# Altium project Hydrogen Bike BMS (100V).PrjPcb (part 1 of 3)
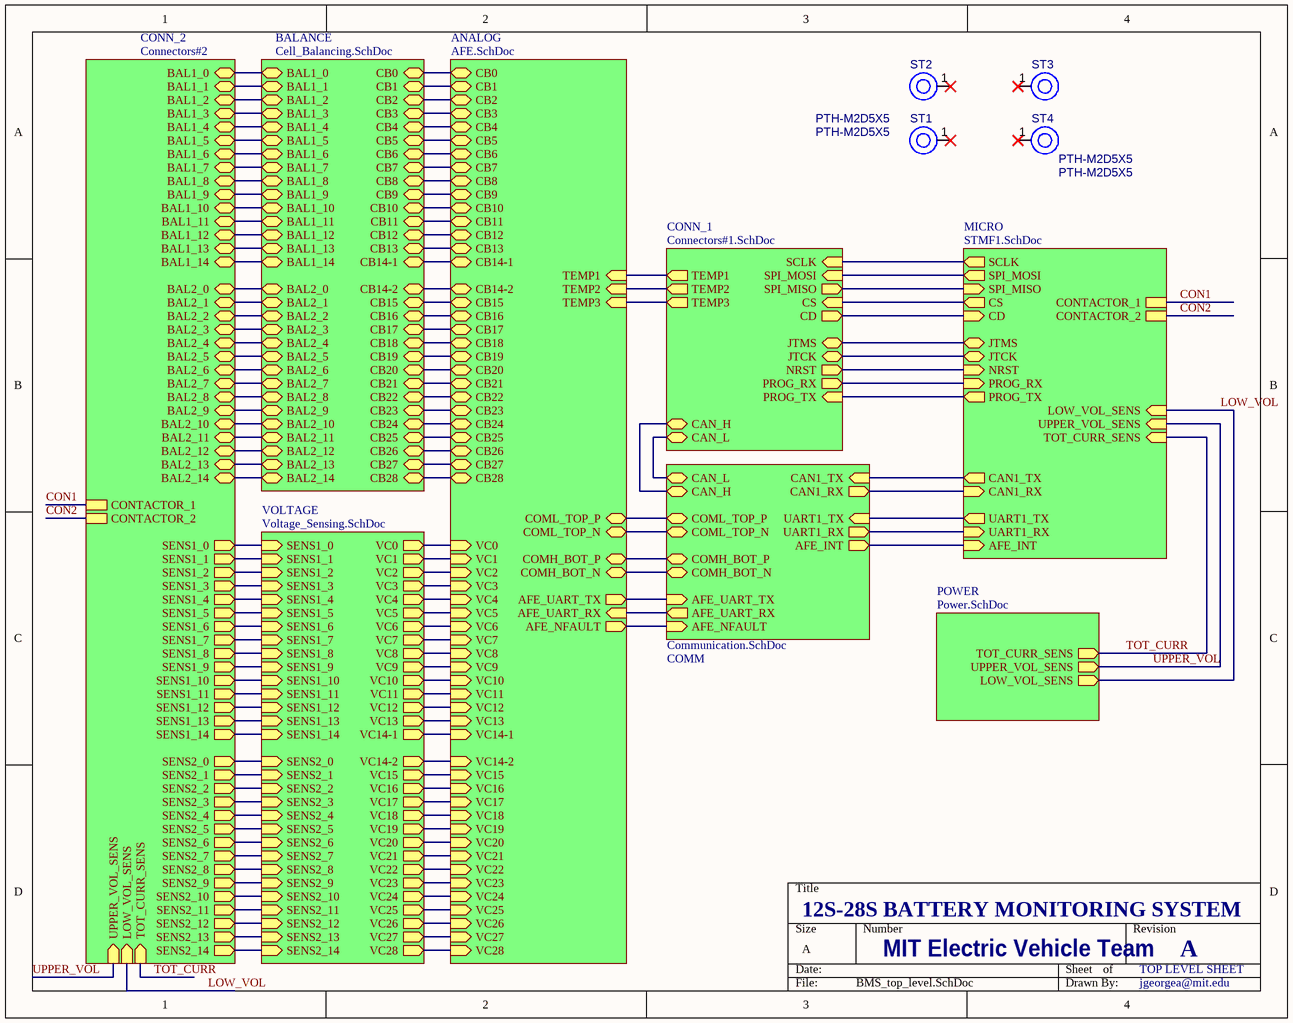
[diagram p0: BMS_top_level.SchDoc]
9 sheets, 279 parts. Net scope: hierarchical (ports join the sheet entries above them; power ports are global).
Board file: PCB1.PcbDoc
Sheets:
  BMS_top_level.SchDoc
    COMM = Communication.SchDoc
    MICRO = STMF1.SchDoc
    CONN_1 = Connectors#1.SchDoc
    ANALOG = AFE.SchDoc
    POWER = Power.SchDoc
    BALANCE = Cell_Balancing.SchDoc
    VOLTAGE = Voltage_Sensing.SchDoc
    CONN_2 = Connectors#2.SchDoc

## Sheet BMS_top_level.SchDoc
size A; SheetNumber: 1; SheetTotal: 9

### Parts
ST1  PTH-M2D5X5  [PTH-M2D5X5]
ST2  PTH-M2D5X5  [PTH-M2D5X5]
ST3  PTH-M2D5X5  [PTH-M2D5X5]
ST4  PTH-M2D5X5  [PTH-M2D5X5]

### Sub-sheets
ANALOG = AFE.SchDoc: COMH_BOT_P (bidir), COMH_BOT_N (bidir), COML_TOP_N (bidir), COML_TOP_P (bidir), CB0 (bidir), CB1 (bidir), CB2 (bidir), CB3 (bidir), CB4 (bidir), CB5 (bidir), CB6 (bidir), CB7 (bidir), CB8 (bidir), CB9 (bidir), CB10 (bidir), CB11 (bidir), CB12 (bidir), CB13 (bidir), CB14-1 (bidir), VC0 (in), VC1 (in), VC2 (in), VC3 (in), VC4 (in), VC5 (in), VC6 (in), VC7 (in), VC8 (in), VC9 (in), VC10 (in), VC11 (in), VC12 (in), VC13 (in), VC14-1 (in), CB14-2 (bidir), CB15 (bidir), CB16 (bidir), CB17 (bidir), CB18 (bidir), CB19 (bidir), CB20 (bidir), CB21 (bidir), CB22 (bidir), CB23 (bidir), CB24 (bidir), CB25 (bidir), CB26 (bidir), CB27 (bidir), CB28 (bidir), VC14-2 (in), VC15 (in), VC16 (in), VC17 (in), VC18 (in), VC19 (in), VC20 (in), VC21 (in), VC22 (in), VC23 (in), VC24 (in), VC25 (in), VC26 (in), VC27 (in), VC28 (in), AFE_UART_TX (out), AFE_UART_RX (in), AFE_NFAULT (out), TEMP1 (in), TEMP2 (in), TEMP3 (in)
BALANCE = Cell_Balancing.SchDoc: CB0 (bidir), CB1 (bidir), CB2 (bidir), CB3 (bidir), CB4 (bidir), CB5 (bidir), CB6 (bidir), CB7 (bidir), CB8 (bidir), CB9 (bidir), CB10 (bidir), CB11 (bidir), CB12 (bidir), CB13 (bidir), CB14-1 (bidir), CB14-2 (bidir), CB15 (bidir), CB16 (bidir), CB17 (bidir), CB18 (bidir), CB19 (bidir), CB20 (bidir), CB21 (bidir), CB22 (bidir), CB23 (bidir), CB24 (bidir), CB25 (bidir), CB26 (bidir), CB27 (bidir), CB28 (bidir), BAL1_0 (bidir), BAL1_1 (bidir), BAL1_2 (bidir), BAL1_3 (bidir), BAL1_4 (bidir), BAL1_5 (bidir), BAL1_6 (bidir), BAL1_7 (bidir), BAL1_8 (bidir), BAL1_9 (bidir), BAL1_10 (bidir), BAL1_11 (bidir), BAL1_12 (bidir), BAL1_13 (bidir), BAL1_14 (bidir), BAL2_0 (bidir), BAL2_1 (bidir), BAL2_2 (bidir), BAL2_3 (bidir), BAL2_4 (bidir), BAL2_5 (bidir), BAL2_6 (bidir), BAL2_7 (bidir), BAL2_8 (bidir), BAL2_9 (bidir), BAL2_10 (bidir), BAL2_11 (bidir), BAL2_12 (bidir), BAL2_13 (bidir), BAL2_14 (bidir)
COMM = Communication.SchDoc: CAN_H (bidir), CAN_L (bidir), CAN1_RX (out), CAN1_TX (in), COMH_BOT_P (bidir), COMH_BOT_N (bidir), COML_TOP_P (bidir), COML_TOP_N (bidir), AFE_UART_TX (in), UART1_RX (out), UART1_TX (in), AFE_UART_RX (out), AFE_NFAULT (in), AFE_INT (out)
CONN_1 = Connectors#1.SchDoc: SPI_MISO (out), SCLK (in), SPI_MOSI (in), CS (in), PROG_RX (out), PROG_TX (in), NRST (out), JTCK (bidir), JTMS (bidir), CAN_H (bidir), CAN_L (bidir), CD (out), TEMP1 (out), TEMP2 (out), TEMP3 (out)
CONN_2 = Connectors#2: SENS1_0 (out), SENS1_1 (out), SENS1_2 (out), SENS1_3 (out), SENS1_4 (out), SENS1_5 (out), SENS1_6 (out), SENS1_7 (out), SENS1_8 (out), SENS1_9 (out), SENS1_10 (out), SENS1_11 (out), SENS1_12 (out), SENS1_13 (out), SENS1_14 (out), SENS2_0 (out), SENS2_1 (out), SENS2_2 (out), SENS2_3 (out), SENS2_4 (out), SENS2_5 (out), SENS2_6 (out), SENS2_7 (out), SENS2_8 (out), SENS2_9 (out), SENS2_10 (out), SENS2_11 (out), SENS2_12 (out), SENS2_13 (out), SENS2_14 (out), BAL1_0 (bidir), BAL1_1 (bidir), BAL1_2 (bidir), BAL1_3 (bidir), BAL1_4 (bidir), BAL1_5 (bidir), BAL1_6 (bidir), BAL1_7 (bidir), BAL1_8 (bidir), BAL1_9 (bidir), BAL1_10 (bidir), BAL1_11 (bidir), BAL1_12 (bidir), BAL1_13 (bidir), BAL1_14 (bidir), BAL2_0 (bidir), BAL2_1 (bidir), BAL2_2 (bidir), BAL2_3 (bidir), BAL2_4 (bidir), BAL2_5 (bidir), BAL2_6 (bidir), BAL2_7 (bidir), BAL2_8 (bidir), BAL2_9 (bidir), BAL2_10 (bidir), BAL2_11 (bidir), BAL2_12 (bidir), BAL2_13 (bidir), BAL2_14 (bidir), CONTACTOR_2, CONTACTOR_1, UPPER_VOL_SENS (in), LOW_VOL_SENS (in), TOT_CURR_SENS (in)
MICRO = STMF1.SchDoc: NRST (in), SCLK (out), SPI_MISO (in), SPI_MOSI (out), CS (out), UART1_TX (out), UART1_RX (in), CAN1_RX (in), CAN1_TX (out), JTMS (bidir), JTCK (bidir), PROG_RX (in), PROG_TX (out), AFE_INT (in), CD (in), TOT_CURR_SENS (in), CONTACTOR_1, CONTACTOR_2, LOW_VOL_SENS (in), UPPER_VOL_SENS (in)
POWER = Power.SchDoc: TOT_CURR_SENS (out), UPPER_VOL_SENS (out), LOW_VOL_SENS (out)
VOLTAGE = Voltage_Sensing.SchDoc: VC0 (out), VC1 (out), VC2 (out), VC3 (out), VC4 (out), VC5 (out), SENS1_0 (in), VC6 (out), VC7 (out), VC8 (out), VC9 (out), VC10 (out), VC11 (out), VC12 (out), VC13 (out), VC14-1 (out), VC14-2 (out), VC15 (out), VC16 (out), VC17 (out), VC18 (out), VC19 (out), VC20 (out), VC21 (out), VC22 (out), VC23 (out), VC24 (out), VC25 (out), VC26 (out), VC27 (out), VC28 (out), SENS1_1 (in), SENS1_2 (in), SENS1_3 (in), SENS1_4 (in), SENS1_5 (in), SENS1_6 (in), SENS1_7 (in), SENS1_8 (in), SENS1_9 (in), SENS1_10 (in), SENS1_11 (in), SENS1_12 (in), SENS1_13 (in), SENS1_14 (in), SENS2_0 (in), SENS2_1 (in), SENS2_2 (in), SENS2_3 (in), SENS2_4 (in), SENS2_5 (in), SENS2_6 (in), SENS2_7 (in), SENS2_8 (in), SENS2_9 (in), SENS2_10 (in), SENS2_11 (in), SENS2_12 (in), SENS2_13 (in), SENS2_14 (in)

### Nets
AFE_NFAULT: sheet COMM/AFE_NFAULT, sheet ANALOG/AFE_NFAULT
AFE_UART_N: sheet COMM/AFE_UART_RX, sheet ANALOG/AFE_UART_RX
AFE_UART_P: sheet COMM/AFE_UART_TX, sheet ANALOG/AFE_UART_TX
CAN1_N: sheet COMM/CAN1_TX, sheet MICRO/CAN1_TX
CAN1_P: sheet COMM/CAN1_RX, sheet MICRO/CAN1_RX
CAN_N: sheet COMM/CAN_L, sheet CONN_1/CAN_L
CAN_P: sheet COMM/CAN_H, sheet CONN_1/CAN_H
CB11: sheet ANALOG/CB11, sheet BALANCE/CB11
CB21: sheet ANALOG/CB21, sheet BALANCE/CB21
COMH_BOT_N: sheet COMM/COMH_BOT_N, sheet ANALOG/COMH_BOT_N
COMH_BOT_P: sheet COMM/COMH_BOT_P, sheet ANALOG/COMH_BOT_P
COML_TOP_N: sheet COMM/COML_TOP_N, sheet ANALOG/COML_TOP_N
COML_TOP_P: sheet COMM/COML_TOP_P, sheet ANALOG/COML_TOP_P
CON1: sheet MICRO/CONTACTOR_1, sheet CONN_2/CONTACTOR_1
CON2: sheet MICRO/CONTACTOR_2, sheet CONN_2/CONTACTOR_2
JTCK: sheet MICRO/JTCK, sheet CONN_1/JTCK
JTMS: sheet MICRO/JTMS, sheet CONN_1/JTMS
LOW_VOL: sheet MICRO/LOW_VOL_SENS, sheet POWER/LOW_VOL_SENS, sheet CONN_2/LOW_VOL_SENS
NRST: sheet MICRO/NRST, sheet CONN_1/NRST
PROG_N: sheet MICRO/PROG_RX, sheet CONN_1/PROG_RX
PROG_P: sheet MICRO/PROG_TX, sheet CONN_1/PROG_TX
TOT_CURR: sheet MICRO/TOT_CURR_SENS, sheet POWER/TOT_CURR_SENS, sheet CONN_2/TOT_CURR_SENS
UART1_N: sheet COMM/UART1_TX, sheet MICRO/UART1_TX
UART1_P: sheet COMM/UART1_RX, sheet MICRO/UART1_RX
UPPER_VOL: sheet MICRO/UPPER_VOL_SENS, sheet POWER/UPPER_VOL_SENS, sheet CONN_2/UPPER_VOL_SENS
VC11: sheet ANALOG/VC11, sheet VOLTAGE/VC11
VC21: sheet ANALOG/VC21, sheet VOLTAGE/VC21
NetC21_1: sheet ANALOG/CB1, sheet BALANCE/CB1
NetC21_2: sheet ANALOG/CB0, sheet BALANCE/CB0
NetC22_1: sheet ANALOG/CB2, sheet BALANCE/CB2
NetC23_1: sheet ANALOG/CB3, sheet BALANCE/CB3
NetC24_1: sheet ANALOG/CB4, sheet BALANCE/CB4
NetC25_1: sheet ANALOG/CB5, sheet BALANCE/CB5
NetC26_1: sheet ANALOG/CB6, sheet BALANCE/CB6
NetC27_1: sheet ANALOG/CB7, sheet BALANCE/CB7
NetC28_1: sheet ANALOG/CB8, sheet BALANCE/CB8
NetC29_1: sheet ANALOG/CB9, sheet BALANCE/CB9
NetC30_1: sheet ANALOG/CB10, sheet BALANCE/CB10
NetC32_1: sheet ANALOG/CB12, sheet BALANCE/CB12
NetC33_1: sheet ANALOG/CB13, sheet BALANCE/CB13
NetC34_1: sheet ANALOG/CB14-1, sheet BALANCE/CB14-1
NetC61_1: sheet ANALOG/CB15, sheet BALANCE/CB15
NetC61_2: sheet ANALOG/CB14-2, sheet BALANCE/CB14-2
NetC62_1: sheet ANALOG/CB16, sheet BALANCE/CB16
NetC63_1: sheet ANALOG/CB17, sheet BALANCE/CB17
NetC64_1: sheet ANALOG/CB18, sheet BALANCE/CB18
NetC65_1: sheet ANALOG/CB19, sheet BALANCE/CB19
NetC66_1: sheet ANALOG/CB20, sheet BALANCE/CB20
NetC68_1: sheet ANALOG/CB22, sheet BALANCE/CB22
NetC70_1: sheet ANALOG/CB23, sheet BALANCE/CB23
NetC71_1: sheet ANALOG/CB24, sheet BALANCE/CB24
NetC72_1: sheet ANALOG/CB25, sheet BALANCE/CB25
NetC73_1: sheet ANALOG/CB26, sheet BALANCE/CB26
NetC74_1: sheet ANALOG/CB27, sheet BALANCE/CB27
NetC75_1: sheet ANALOG/CB28, sheet BALANCE/CB28
NetC80_1: sheet ANALOG/VC0, sheet VOLTAGE/VC0
NetC81_1: sheet ANALOG/VC1, sheet VOLTAGE/VC1
NetC82_1: sheet ANALOG/VC2, sheet VOLTAGE/VC2
NetC83_1: sheet ANALOG/VC3, sheet VOLTAGE/VC3
NetC84_1: sheet ANALOG/VC4, sheet VOLTAGE/VC4
NetC85_1: sheet ANALOG/VC5, sheet VOLTAGE/VC5
NetC86_1: sheet ANALOG/VC6, sheet VOLTAGE/VC6
NetC87_1: sheet ANALOG/VC7, sheet VOLTAGE/VC7
NetC88_1: sheet ANALOG/VC8, sheet VOLTAGE/VC8
NetC89_1: sheet ANALOG/VC9, sheet VOLTAGE/VC9
NetC90_1: sheet ANALOG/VC10, sheet VOLTAGE/VC10
NetC92_1: sheet ANALOG/VC12, sheet VOLTAGE/VC12
NetC93_1: sheet ANALOG/VC13, sheet VOLTAGE/VC13
NetC94_1: sheet ANALOG/VC14-1, sheet VOLTAGE/VC14-1
NetC95_1: sheet ANALOG/VC14-2, sheet VOLTAGE/VC14-2
NetC96_1: sheet ANALOG/VC15, sheet VOLTAGE/VC15
NetC97_1: sheet ANALOG/VC16, sheet VOLTAGE/VC16
NetC98_1: sheet ANALOG/VC17, sheet VOLTAGE/VC17
NetC99_1: sheet ANALOG/VC18, sheet VOLTAGE/VC18
NetC100_1: sheet ANALOG/VC19, sheet VOLTAGE/VC19
NetC101_1: sheet ANALOG/VC20, sheet VOLTAGE/VC20
NetC103_1: sheet ANALOG/VC22, sheet VOLTAGE/VC22
NetC104_1: sheet ANALOG/VC23, sheet VOLTAGE/VC23
NetC105_1: sheet ANALOG/VC24, sheet VOLTAGE/VC24
NetC106_1: sheet ANALOG/VC25, sheet VOLTAGE/VC25
NetC107_1: sheet ANALOG/VC26, sheet VOLTAGE/VC26
NetC108_1: sheet ANALOG/VC27, sheet VOLTAGE/VC27
NetC109_1: sheet ANALOG/VC28, sheet VOLTAGE/VC28
NetJ2_2: sheet MICRO/CS, sheet CONN_1/CS
NetJ2_3: sheet MICRO/SPI_MOSI, sheet CONN_1/SPI_MOSI
NetJ2_5: sheet MICRO/SCLK, sheet CONN_1/SCLK
NetJ2_7: sheet MICRO/SPI_MISO, sheet CONN_1/SPI_MISO
NetJ2_10: sheet MICRO/CD, sheet CONN_1/CD
NetJ4_1: sheet BALANCE/BAL1_0, sheet CONN_2/BAL1_0
NetJ4_2: sheet BALANCE/BAL1_1, sheet CONN_2/BAL1_1
NetJ4_3: sheet BALANCE/BAL1_2, sheet CONN_2/BAL1_2
NetJ4_4: sheet BALANCE/BAL1_3, sheet CONN_2/BAL1_3
NetJ4_5: sheet BALANCE/BAL1_4, sheet CONN_2/BAL1_4
NetJ4_6: sheet BALANCE/BAL1_5, sheet CONN_2/BAL1_5
NetJ4_7: sheet BALANCE/BAL1_6, sheet CONN_2/BAL1_6
NetJ4_8: sheet BALANCE/BAL1_7, sheet CONN_2/BAL1_7
NetJ4_9: sheet BALANCE/BAL1_8, sheet CONN_2/BAL1_8
NetJ4_10: sheet BALANCE/BAL1_9, sheet CONN_2/BAL1_9
NetJ4_11: sheet BALANCE/BAL1_10, sheet CONN_2/BAL1_10
NetJ4_12: sheet BALANCE/BAL1_11, sheet CONN_2/BAL1_11
NetJ4_13: sheet BALANCE/BAL1_12, sheet CONN_2/BAL1_12
NetJ4_14: sheet BALANCE/BAL1_13, sheet CONN_2/BAL1_13
NetJ4_15: sheet BALANCE/BAL1_14, sheet CONN_2/BAL1_14
NetJ5_1: sheet BALANCE/BAL2_0, sheet CONN_2/BAL2_0
NetJ5_2: sheet BALANCE/BAL2_1, sheet CONN_2/BAL2_1
NetJ5_3: sheet BALANCE/BAL2_2, sheet CONN_2/BAL2_2
NetJ5_4: sheet BALANCE/BAL2_3, sheet CONN_2/BAL2_3
NetJ5_5: sheet BALANCE/BAL2_4, sheet CONN_2/BAL2_4
NetJ5_6: sheet BALANCE/BAL2_5, sheet CONN_2/BAL2_5
NetJ5_7: sheet BALANCE/BAL2_6, sheet CONN_2/BAL2_6
NetJ5_8: sheet BALANCE/BAL2_7, sheet CONN_2/BAL2_7
NetJ5_9: sheet BALANCE/BAL2_8, sheet CONN_2/BAL2_8
NetJ5_10: sheet BALANCE/BAL2_9, sheet CONN_2/BAL2_9
NetJ5_11: sheet BALANCE/BAL2_10, sheet CONN_2/BAL2_10
NetJ5_12: sheet BALANCE/BAL2_11, sheet CONN_2/BAL2_11
NetJ5_13: sheet BALANCE/BAL2_12, sheet CONN_2/BAL2_12
NetJ5_14: sheet BALANCE/BAL2_13, sheet CONN_2/BAL2_13
NetJ5_15: sheet BALANCE/BAL2_14, sheet CONN_2/BAL2_14
NetJ6_1: sheet VOLTAGE/SENS2_0, sheet CONN_2/SENS2_0
NetJ6_2: sheet VOLTAGE/SENS2_1, sheet CONN_2/SENS2_1
NetJ6_3: sheet VOLTAGE/SENS2_2, sheet CONN_2/SENS2_2
NetJ6_4: sheet VOLTAGE/SENS2_3, sheet CONN_2/SENS2_3
NetJ6_5: sheet VOLTAGE/SENS2_4, sheet CONN_2/SENS2_4
NetJ6_6: sheet VOLTAGE/SENS2_5, sheet CONN_2/SENS2_5
NetJ6_7: sheet VOLTAGE/SENS2_6, sheet CONN_2/SENS2_6
NetJ6_8: sheet VOLTAGE/SENS2_7, sheet CONN_2/SENS2_7
NetJ6_9: sheet VOLTAGE/SENS2_8, sheet CONN_2/SENS2_8
NetJ6_10: sheet VOLTAGE/SENS2_9, sheet CONN_2/SENS2_9
NetJ6_11: sheet VOLTAGE/SENS2_10, sheet CONN_2/SENS2_10
NetJ6_12: sheet VOLTAGE/SENS2_11, sheet CONN_2/SENS2_11
NetJ6_13: sheet VOLTAGE/SENS2_12, sheet CONN_2/SENS2_12
NetJ6_14: sheet VOLTAGE/SENS2_13, sheet CONN_2/SENS2_13
NetJ6_15: sheet VOLTAGE/SENS2_14, sheet CONN_2/SENS2_14
NetJ7_1: sheet VOLTAGE/SENS1_0, sheet CONN_2/SENS1_0
NetJ7_2: sheet VOLTAGE/SENS1_1, sheet CONN_2/SENS1_1
NetJ7_3: sheet VOLTAGE/SENS1_2, sheet CONN_2/SENS1_2
NetJ7_4: sheet VOLTAGE/SENS1_3, sheet CONN_2/SENS1_3
NetJ7_5: sheet VOLTAGE/SENS1_4, sheet CONN_2/SENS1_4
NetJ7_6: sheet VOLTAGE/SENS1_5, sheet CONN_2/SENS1_5
NetJ7_7: sheet VOLTAGE/SENS1_6, sheet CONN_2/SENS1_6
NetJ7_8: sheet VOLTAGE/SENS1_7, sheet CONN_2/SENS1_7
NetJ7_9: sheet VOLTAGE/SENS1_8, sheet CONN_2/SENS1_8
NetJ7_10: sheet VOLTAGE/SENS1_9, sheet CONN_2/SENS1_9
NetJ7_11: sheet VOLTAGE/SENS1_10, sheet CONN_2/SENS1_10
NetJ7_12: sheet VOLTAGE/SENS1_11, sheet CONN_2/SENS1_11
NetJ7_13: sheet VOLTAGE/SENS1_12, sheet CONN_2/SENS1_12
NetJ7_14: sheet VOLTAGE/SENS1_13, sheet CONN_2/SENS1_13
NetJ7_15: sheet VOLTAGE/SENS1_14, sheet CONN_2/SENS1_14
NetP1_1: sheet CONN_1/TEMP1, sheet ANALOG/TEMP1
NetP1_2: sheet CONN_1/TEMP2, sheet ANALOG/TEMP2
NetP1_3: sheet CONN_1/TEMP3, sheet ANALOG/TEMP3
NetU01_15: sheet COMM/AFE_INT, sheet MICRO/AFE_INT

Not connected (* = marked no-connect by the designer): ST1 1(H1)*; ST2 1(H1)*; ST3 1(H1)*; ST4 1(H1)*

### Notes on the sheet
- 12S-28S BATTERY MONITORING SYSTEM
- MIT Electric Vehicle Team
- TOP LEVEL SHEET
- A
- jgeorgea@mit.edu

### Library data of the parts
ST1-ST4 = CMP-00028-00004-2: M2 PTH (2.5mm), 5mm pad; Pins: 1

## Sheet Communication.SchDoc
size A; SheetNumber: 3; SheetTotal: 9
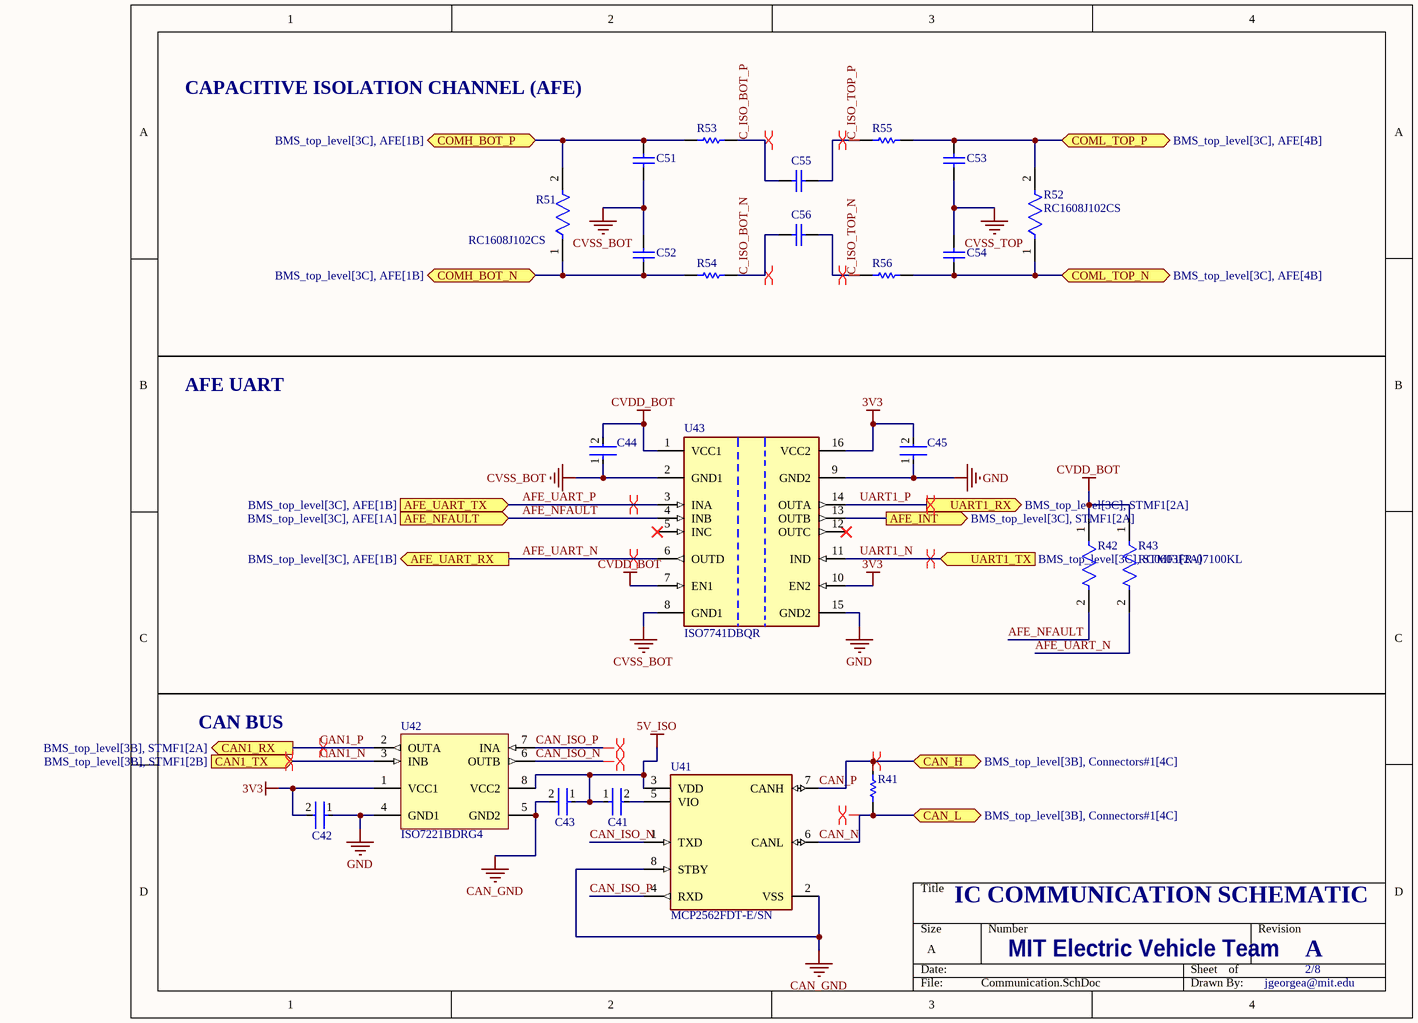
[diagram p1: Communication.SchDoc]

### Parts
C41  CGA3E2X7R1H104K080AA  [FP-CGA3E-0_3-0_1-IPC_A]  (value not drawn)
C42  CGA3E2X7R1H104K080AA  [FP-CGA3E-0_3-0_1-IPC_A]  (value not drawn)
C43  CGA3E2X7R1H104K080AA  [FP-CGA3E-0_3-0_1-IPC_A]  (value not drawn)
C44  CGA3E2X7R1H104K080AA  [FP-CGA3E-0_3-0_1-IPC_A]  (value not drawn)
C45  CGA3E2X7R1H104K080AA  [FP-CGA3E-0_3-0_1-IPC_A]  (value not drawn)
C51  06031C221KAT2A  [CAPC1608X90X35ML15T15]  (value not drawn)
C52  06031C221KAT2A  [CAPC1608X90X35ML15T15]  (value not drawn)
C53  06031C221KAT2A  [CAPC1608X90X35ML15T15]  (value not drawn)
C54  06031C221KAT2A  [CAPC1608X90X35ML15T15]  (value not drawn)
C55  08051C222JAT2A  [CAPC2013X94X50LL20T25]  (value not drawn)
C56  08051C222JAT2A  [CAPC2013X94X50LL20T25]  (value not drawn)
R41  ERJ-3EKF1200V  [RESC1609X55X30ML15T15]  (value not drawn)
R42  RC0603FR-07100KL  [FP-RC0603-0_55-MFG]  (value not drawn)
R43  RC0603FR-07100KL  [FP-RC0603-0_55-MFG]
R51  RC1608J102CS  [FP-RC1608-IPC_A]
R52  RC1608J102CS  [FP-RC1608-IPC_A]
R53  48R7 1% 0603(1608)  [RESC0603(1608)_M]  (value not drawn)
R54  48R7 1% 0603(1608)  [RESC0603(1608)_M]  (value not drawn)
R55  48R7 1% 0603(1608)  [RESC0603(1608)_M]  (value not drawn)
R56  48R7 1% 0603(1608)  [RESC0603(1608)_M]  (value not drawn)
U41  MCP2562FDT-E/SN  [FP-C04-057-SN-MFG]
U42  ISO7221BDRG4  [D0008B_M]
U43  ISO7741DBQR  [FP-DBQ0016A-MFG]

### Ports
AFE_INT (out, see BMS_top_level[3C], STMF1[2A]), AFE_NFAULT (in, see BMS_top_level[3C], AFE[1A]), AFE_UART_RX (out, see BMS_top_level[3C], AFE[1B]), AFE_UART_TX (in, see BMS_top_level[3C], AFE[1B]), CAN1_RX (out, see BMS_top_level[3B], STMF1[2A]), CAN1_TX (in, see BMS_top_level[3B], STMF1[2B]), CAN_H (bidir, see BMS_top_level[3B], Connectors#1[4C]), CAN_L (bidir, see BMS_top_level[3B], Connectors#1[4C]), COMH_BOT_N (bidir, see BMS_top_level[3C], AFE[1B]), COMH_BOT_P (bidir, see BMS_top_level[3C], AFE[1B]), COML_TOP_N (bidir, see BMS_top_level[3C], AFE[4B]), COML_TOP_P (bidir, see BMS_top_level[3C], AFE[4B]), UART1_RX (out, see BMS_top_level[3C], STMF1[2A]), UART1_TX (in, see BMS_top_level[3C], STMF1[2A])

### Nets
3V3: C42.2 C45.2 U42.1(VCC1) U43.10(EN2) U43.16(VCC2)
5V_ISO: C41.1 C43.1 U41.3(VDD) U42.8(VCC2)
CAN_GND: C43.2 U41.2(VSS) U41.8(STBY) U42.5(GND2)
CVDD_BOT: C44.2 R42.1 R43.1 U43.1(VCC1) U43.7(EN1)
CVSS_BOT: C44.1 C51.1 C52.1 U43.2(GND1) U43.8(GND1)  [project net AVSS_BOT]
CVSS_TOP: C53.1 C54.1  [project net AVSS_TOP]
GND: C42.1 C45.1 U42.4(GND1) U43.9(GND2) U43.15(GND2)
AFE_NFAULT: R42.2 U43.4(INB) ; port AFE_NFAULT
AFE_UART_N: R43.2 U43.6(OUTD) ; port AFE_UART_RX
AFE_UART_P: U43.3(INA) ; port AFE_UART_TX
C_ISO_BOT_N: C56.1 R54.2
C_ISO_BOT_P: C55.1 R53.2
C_ISO_TOP_N: C56.2 R56.1
C_ISO_TOP_P: C55.2 R55.1
CAN1_N: U42.3(INB) ; port CAN1_TX
CAN1_P: U42.2(OUTA) ; port CAN1_RX
CAN_ISO_N: U41.1(TXD) U42.6(OUTB)
CAN_ISO_P: U41.4(RXD) U42.7(INA)
CAN_N: R41.1 U41.6(CANL) ; port CAN_L
CAN_P: R41.2 U41.7(CANH) ; port CAN_H
COMH_BOT_N: C52.2 R51.1 R54.1 ; port COMH_BOT_N
COMH_BOT_P: C51.2 R51.2 R53.1 ; port COMH_BOT_P
COML_TOP_N: C54.2 R52.1 R56.2 ; port COML_TOP_N
COML_TOP_P: C53.2 R52.2 R55.2 ; port COML_TOP_P
UART1_N: U43.11(IND) ; port UART1_TX
UART1_P: U43.14(OUTA) ; port UART1_RX
NetC41_2: C41.2 U41.5(VIO)
NetU01_15: U43.13(OUTB) ; port AFE_INT

Not connected (* = marked no-connect by the designer): U43 5(INC)* 12(OUTC)*

### Layout directives
differential pair: AFE_UART_N, AFE_UART_P, C_ISO_BOT_N, C_ISO_BOT_P, C_ISO_TOP_N, C_ISO_TOP_P, CAN1_N, CAN1_P, CAN_ISO_N, CAN_ISO_P, CAN_N, CAN_P, UART1_N, UART1_P

### Notes on the sheet
- CAPACITIVE ISOLATION CHANNEL (AFE)
- AFE UART
- CAN BUS
- IC COMMUNICATION SCHEMATIC
- MIT Electric Vehicle Team
- 2/8
- A
- jgeorgea@mit.edu

### Library data of the parts
C41-C45 = CMP-2000-07546-2: Cap Ceramic 100nF 50V X7R 10% Pad SMD 0603 +125°C Automotive T/R; Weight: 7.1E-05oz; Composition: Ceramic; Max Operating Temperature: 125°C; Termination: SMD/SMT; Dielectric: X7R; Length: 1.6mm; Package Quantity: 1; REACH SVHC: No SVHC; Lead Free: Lead Free; Case Code (Metric): 1608; Min Operating Temperature: -55°C; Packaging: Tape and Reel; Tolerance: 10%; Voltage Rating: 50V; Case Code (Imperial): 0603; Capacitance: 100nF; Case/Package: 0603; Voltage Rating (DC): 50V; Depth: 0.8mm; Radiation Hardening: No; Ratings: AEC-Q200; Mount: Surface Mount; Voltage: 50V; Thickness: 0.035inch; Width: 0.8mm; Height: 0.8mm
C51-C54 = CMP-2006-04084-1: Manufacturer: AVX Interconnect / Elco; Part Number: 06031C221KAT2A
C55 C56 = CMP-2007-04184-1: Manufacturer: AVX Interconnect / Elco; Part Number: 08051C222JAT2A
R41 = CMP-2000-00213-2: Chip Resistor, 120 Ohm, +/- 1%, 0.1 W, -55 to 155 degC, 0603 (1608 Metric), RoHS, Tape and Reel; Manufacturer: Panasonic; Power Rating: 100mW; Voltage Rating (DC): 75V; Resistance: 120Ohm; Temperature Coefficient: 100ppm/degreesC; Number of Terminations: 2; Military Standard: Not; Tolerance: 1%; Min Operating Temperature: -55degC; Packaging: TapeandReel; Lead Free: LeadFree; Max Operating Temperature: 155degC; Manufacturer URL: http://www.panasonic.com/; Case Code (Imperial): 0603; REACH SVHC: NoSVHC; Width: 0.031inch; Datasheet URL: https://industrial.panasonic.com/cdbs/www-data/pdf/RDA0000/AOA0000C283.pdf; RoHSCompliant: true; Max Power Dissipation: 100mW; Termination: SMD/SMT; Package Reference: 0603; Height: 0.022inch; Depth: 0.8mm; Package Description: 2-Pin Surface Mount Device, Body 1.6 x 0.85 mm; Contact Plating: Tin; Length: 1.6mm; Package URL: http://www.st.com/st-web-ui/static/active/en/resource/technical/document/datasheet/CD00001320.pdf; Radiation Hardening: No; Package Quantity: 1; Number of Pins: 2; Datasheet Version: 42095.0; Voltage Rating: 75V; Composition: ThickFilm; Case/Package: 0603; Mount: SurfaceMount; Case Code (Metric): 1608
R42 R43 = CMP-2100-03662-2: RES SMD 100K OHM 1% 1/10W 0603; Voltage Rating (DC): 50V; Resistance: 100kR; Max Power Dissipation: 100mW; Temperature Coefficient: 100ppm/°C; Working Voltage: 75V; Length: 1.6mm; Lead Free: Lead Free; Number of Terminations: 2; Packaging: Tape and Reel; Voltage Rating: 50V; Termination: SMD/SMT; Width: 0.8mm; Resistor Type: Thick Film; Resistance Tolerance: 1%; Features: Moisture Resistant; Height: 0.45mm; Construction: Rectangular; Case/Package: 0603; Military Standard: Not; Case Code (Imperial): 0603; Series: RC; Technology: THICK FILM; Depth: 0.8mm; RoHS Compliant: Yes; REACH SVHC: No SVHC; Min Operating Temperature: -55°C; Case Code (Metric): 1608; Max Operating Temperature: 155°C; Power Rating: 100mW; Number of Pins: 2; Tolerance: 1%
R51 R52 = CMP-13261-002301-1: Res Thick Film 0603 1kΩ 5% 0.1W ±100ppm/°C Molded SMD T/R; Power Rating: 100mW; Resistance: 1kR; Voltage Rating (DC): 50V; Contact Plating: Tin; Mount: Surface Mount; Number of Terminations: 2; Features: Moisture Resistant; Max Power Dissipation: 100mW; Military Standard: Not; Case/Package: 0603; Radiation Hardening: No; Temperature Coefficient: 100ppm/°C; Length: 1.6mm; Height: 0.022inch; Case Code (Metric): 1608; Max Operating Temperature: 155°C; Composition: Thick Film; Tolerance: 5%; Width: 0.031inch; Depth: 0.8mm; Packaging: Tape and Reel; Lead Free: Lead Free; Case Code (Imperial): 0603; Min Operating Temperature: -55°C
R53-R56 = CMP-1012-00362-1: 48R7 0.1W 1% 0603 (1608 Metric)  SMD; Case-Metric: 1608; Case-EIA: 0603; Value: 48.70 Ohm; Power: 0.1 W; Tolerance: 1 %; Technology: SMT
U41 = CMP-06279-000005-1: IC TRANSCEIVER 1/1 8SOIC; Operating Supply Current: 70mA; Data Rate: 8Mbps; Number of Transceivers: 1; Receiver Hysteresis: 200mV; Max Supply Voltage: 5.5V; Min Supply Voltage: 4.5V; Weight: 0.019048oz; Package Quantity: 3300; Case/Package: SOIC; Mount: Surface Mount; Max Operating Temperature: 125°C; Min Operating Temperature: -40°C; Packaging: Tape and Reel; Number of Pins: 8
U42 = CMP-0328-00081-3: 5 Mbps Dual Channels, 1 / 1, Digital Isolator, 3.3 V / 5 V, -40 to +125 degC, 8-pin SOIC (D), Green (RoHS & no Sb/Br); Manufacturer: Texas Instruments; TTL/CMOS Input Threshold: TTL; Input Noise Filter: Yes; Datarate(Mbps): 5; Insulation Rating(VRMS): 2500; Rating: Catalog; Supply Voltage(s)(V): 3.3, 5; Eco-Plan: Green (RoHS & no Sb/Br); SubFamily: Isolator; PackageReference: D0008B; ComponentLink3URL: SamplesURL:http://www.ti.com/product/iso7221b#samples; ComponentLink1URL: http://www.ti.com/; ComponentLink2Description: Datasheet; Mounting Technology: Surface Mount; ComponentLink1Description: Manufacturer URL; Channel Configuration: 02/01/2000; PartNumber: ISO7221BDRG4; PackageVersion: revM, Jun-2011; ComponentLink2URL: http://www.ti.com/general/docs/lit/getliterature.tsp?genericPartNumber=ISO7221B&fileType=pdf; DatasheetVersion: SLLS755L; Thermal Shutdown: No; PackageDescription: 8-Pin Plastic Small Outline Integrated Circuit, 4.9 x 3.9 mm, Pitch 1.27 mm Pitch; ComponentLink3Description: URL Link1
U43 = CMP-04872-000008-1: Manufacturer: Texas Instruments; Nominal Supply Current: 0.8-18mA; Standoff Height: 0.11mm; Interface: SPI; Max Supply Voltage: 5.5V; Min Supply Voltage: 2.25V; Max Junction Temp: +150°C; Automotive: No; Ambient Temperature Range High: +125°C; Height: 1.75mm; Octopart: https://octopart.com/iso7741dbqr-texas+instruments-82338409; Temperature Range High: +125°C; Device Class L1: Integrated Circuits (ICs); Lead Free: Yes; Ambient Temperature Range Low: -55°C; Digikey Description: ISO7741DBQR; Package: DBQ0016A; Temperature: -55°C to +125°C; ComponentLink2URL: http://www.ti.com/lit/ds/symlink/iso7741.pdf; Category: IC; Manufacturer Part Number: ISO7741DBQR; Device Class L2: Interface ICs; Mouser Description: High-speed, low-power, robust EMC quad-channel digital isolator 16-SSOP -55 to 125; ComponentLink2Description: Datasheet; Temperature Range Low: -55°C; Device Class L3: unset; RoHS: TRUE

## Sheet STMF1.SchDoc
size A; SheetNumber: 2; SheetTotal: 9
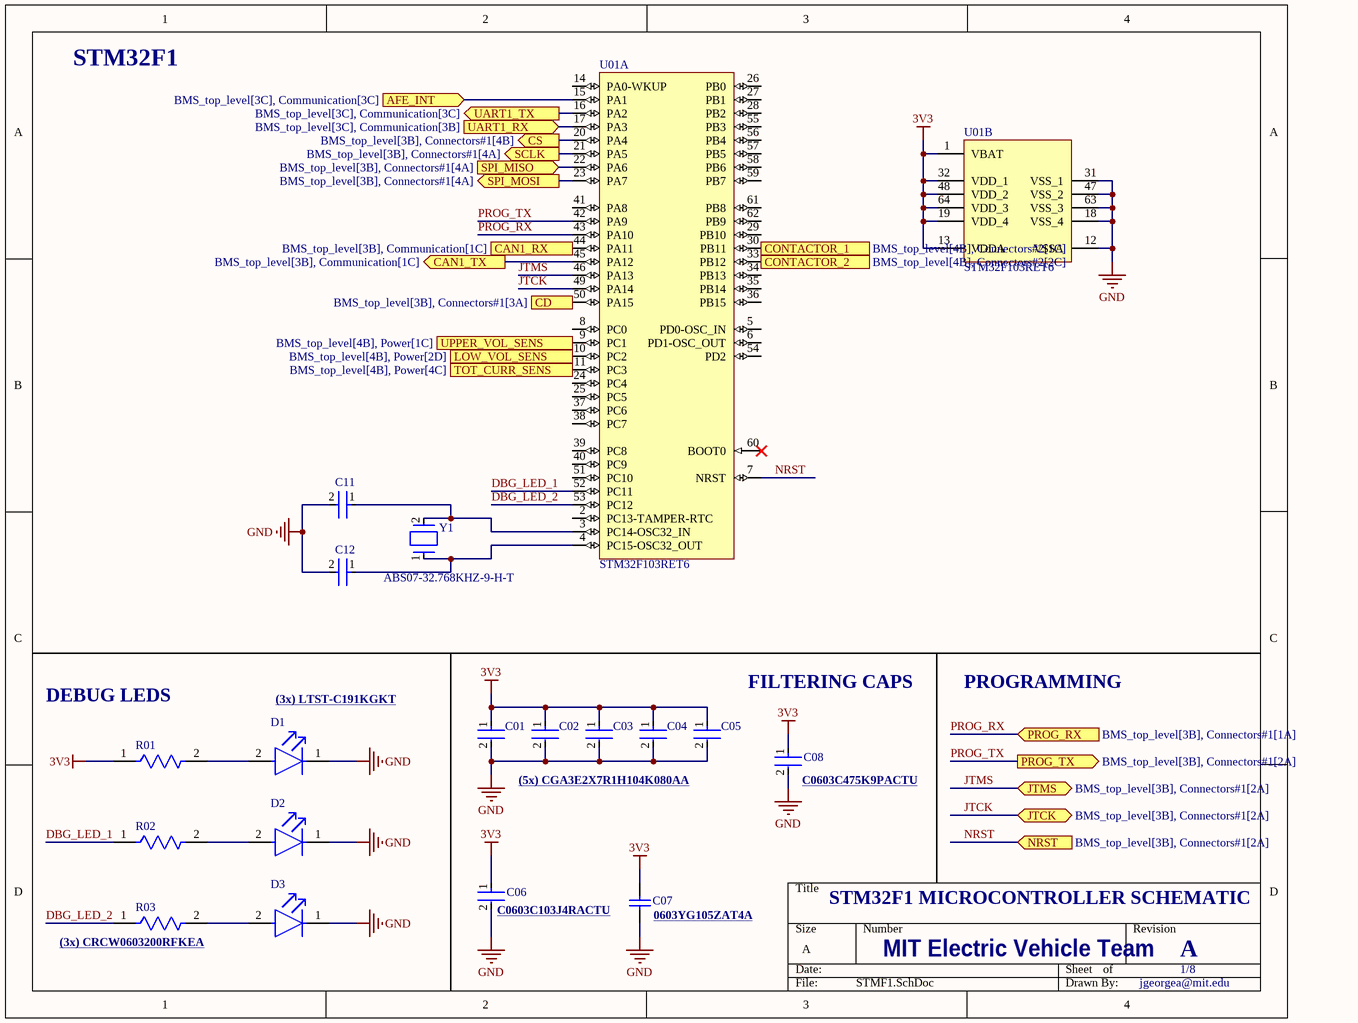
[diagram p2: STMF1.SchDoc]

### Parts
C01  CGA3E2X7R1H104K080AA  [FP-CGA3E-0_3-0_1-IPC_A]  (value not drawn)
C02  CGA3E2X7R1H104K080AA  [FP-CGA3E-0_3-0_1-IPC_A]  (value not drawn)
C03  CGA3E2X7R1H104K080AA  [FP-CGA3E-0_3-0_1-IPC_A]  (value not drawn)
C04  CGA3E2X7R1H104K080AA  [FP-CGA3E-0_3-0_1-IPC_A]  (value not drawn)
C05  CGA3E2X7R1H104K080AA  [FP-CGA3E-0_3-0_1-IPC_A]  (value not drawn)
C06  C0603C103J4RACTU  [FP-C0603C-CF-MFG]  (value not drawn)
C07  0603YG105ZAT4A  [CAPC1608X90X35ML15T15]  (value not drawn)
C08  C0603C475K9PACTU  [FP-C0603-CG-MFG]  (value not drawn)
C11  CBR06C409A1GAC  [FP-CBR06C-MFG]  (value not drawn)
C12  CBR06C409A1GAC  [FP-CBR06C-MFG]  (value not drawn)
D1  LTST-C191KGKT  [FP-LTST-C191KGKT-MFG]  (value not drawn)
D2  LTST-C191KGKT  [FP-LTST-C191KGKT-MFG]  (value not drawn)
D3  LTST-C191KGKT  [FP-LTST-C191KGKT-MFG]  (value not drawn)
R01  CRCW0603200RFKEA  [FP-CRCW0603-e3-MFG]  (value not drawn)
R02  CRCW0603200RFKEA  [FP-CRCW0603-e3-MFG]  (value not drawn)
R03  CRCW0603200RFKEA  [FP-CRCW0603-e3-MFG]  (value not drawn)
U01  STM32F103RET6  [STM-LQFP64_L]  (parts A,B of 2)
Y1  ABS07-32.768KHZ-9-H-T  [FP-ABS07-MFG]

### Ports
AFE_INT (in, see BMS_top_level[3C], Communication[3C]), CAN1_RX (in, see BMS_top_level[3B], Communication[1C]), CAN1_TX (out, see BMS_top_level[3B], Communication[1C]), CD (in, see BMS_top_level[3B], Connectors#1[3A]), CONTACTOR_1 (see BMS_top_level[4B], Connectors#2[1C]), CONTACTOR_2 (see BMS_top_level[4B], Connectors#2[2C]), CS (out, see BMS_top_level[3B], Connectors#1[4B]), JTCK (bidir, see BMS_top_level[3B], Connectors#1[2A]), JTMS (bidir, see BMS_top_level[3B], Connectors#1[2A]), LOW_VOL_SENS (in, see BMS_top_level[4B], Power[2D]), NRST (in, see BMS_top_level[3B], Connectors#1[2A]), PROG_RX (in, see BMS_top_level[3B], Connectors#1[1A]), PROG_TX (out, see BMS_top_level[3B], Connectors#1[2A]), SCLK (out, see BMS_top_level[3B], Connectors#1[4A]), SPI_MISO (in, see BMS_top_level[3B], Connectors#1[4A]), SPI_MOSI (out, see BMS_top_level[3B], Connectors#1[4A]), TOT_CURR_SENS (in, see BMS_top_level[4B], Power[4C]), UART1_RX (in, see BMS_top_level[3C], Communication[3B]), UART1_TX (out, see BMS_top_level[3C], Communication[3C]), UPPER_VOL_SENS (in, see BMS_top_level[4B], Power[1C])

### Nets
3V3: C01.1 C02.1 C03.1 C04.1 C05.1 C06.1 C07.2 C08.1 R01.1 U01.1(VBAT) U01.13(VDDA) U01.19(VDD_4) U01.32(VDD_1) U01.48(VDD_2) U01.64(VDD_3)
GND: C01.2 C02.2 C03.2 C04.2 C05.2 C06.2 C07.1 C08.2 C11.2 C12.2 D1.1(C) D2.1(C) D3.1(C) U01.12(VSSA) U01.18(VSS_4) U01.31(VSS_1) U01.47(VSS_2) U01.63(VSS_3)
CAN1_N: U01.45(PA12) ; port CAN1_TX
CAN1_P: U01.44(PA11) ; port CAN1_RX
CON1: U01.30(PB11) ; port CONTACTOR_1
CON2: U01.33(PB12) ; port CONTACTOR_2
DBG_LED_1: R02.1 U01.52(PC11)
DBG_LED_2: R03.1 U01.53(PC12)
JTCK: U01.49(PA14) ; port JTCK
JTMS: U01.46(PA13) ; port JTMS
LOW_VOL: U01.10(PC2) ; port LOW_VOL_SENS
NRST: U01.7(NRST) ; port NRST
PROG_RX: U01.43(PA10) ; port PROG_RX  [project net PROG_N]
PROG_TX: U01.42(PA9) ; port PROG_TX  [project net PROG_P]
TOT_CURR: U01.11(PC3) ; port TOT_CURR_SENS
UART1_N: U01.16(PA2) ; port UART1_TX
UART1_P: U01.17(PA3) ; port UART1_RX
UPPER_VOL: U01.9(PC1) ; port UPPER_VOL_SENS
NetC11_1: C11.1 U01.3(PC14-OSC32_IN) Y1.2
NetC12_1: C12.1 U01.4(PC15-OSC32_OUT) Y1.1
NetD1_2: D1.2(A) R01.2
NetD2_2: D2.2(A) R02.2
NetD3_2: D3.2(A) R03.2
NetJ2_2: U01.20(PA4) ; port CS
NetJ2_3: U01.23(PA7) ; port SPI_MOSI
NetJ2_5: U01.21(PA5) ; port SCLK
NetJ2_7: U01.22(PA6) ; port SPI_MISO
NetJ2_10: U01.50(PA15) ; port CD
NetU01_15: U01.15(PA1) ; port AFE_INT

Not connected (* = marked no-connect by the designer): U01 2(PC13-TAMPER-RTC) 5(PD0-OSC_IN) 6(PD1-OSC_OUT) 8(PC0) 14(PA0-WKUP) 24(PC4) 25(PC5) 26(PB0) 27(PB1) 28(PB2) 29(PB10) 34(PB13) 35(PB14) 36(PB15) 37(PC6) 38(PC7) 39(PC8) 40(PC9) 41(PA8) 51(PC10) 54(PD2) 55(PB3) 56(PB4) 57(PB5) 58(PB6) 59(PB7) 60(BOOT0)* 61(PB8) 62(PB9)

### Notes on the sheet
- STM32F1
- DEBUG LEDS
- (3x) LTST-C191KGKT
- FILTERING CAPS
- PROGRAMMING
- (5x) CGA3E2X7R1H104K080AA
- (near C08) C0603C475K9PACTU
- STM32F1 MICROCONTROLLER SCHEMATIC
- (near R03) (3x) CRCW0603200RFKEA
- (near C06) C0603C103J4RACTU
- (near C07) 0603YG105ZAT4A
- MIT Electric Vehicle Team
- A
- 1/8
- jgeorgea@mit.edu

### Library data of the parts
C01 C02 C03 C04 C05 = CMP-2000-07546-2: as C41 on sheet Communication; Weight: 7.1E-05oz; Composition: Ceramic; Max Operating Temperature: 125°C; Termination: SMD/SMT; Dielectric: X7R; Length: 1.6mm; Package Quantity: 1; REACH SVHC: No SVHC; Lead Free: Lead Free; Case Code (Metric): 1608; Min Operating Temperature: -55°C; Packaging: Tape and Reel; Tolerance: 10%; Voltage Rating: 50V; Case Code (Imperial): 0603; Capacitance: 100nF; Case/Package: 0603; Voltage Rating (DC): 50V; Depth: 0.8mm; Radiation Hardening: No; Ratings: AEC-Q200; Mount: Surface Mount; Voltage: 50V; Thickness: 0.035inch; Width: 0.8mm; Height: 0.8mm
C06 = CMP-2006-03033-2: CAP CER 10000PF 16V 5% X7R 0603; Manufacturer: KEMET; Value: 10,000 pF; Tolerance: 0.05; Material: Ceramic; Temperature Coefficient: 30ppm/°C; Automotive Grade: Grade 1; Height: 0.87mm; Temperature Range High: +125°C; Temperature Range Low: -55°C; Automotive: Yes; Package: C0603C-CF; Temperature Characteristic: X7R; RoHS: TRUE; Device Class L2: Capacitors; Device Class L3: Ceramic Capacitors; Device Class L1: Passive Components; Manufacturer Part Number: C0603C103J4RACTU; Voltage Rating: 16 V; ComponentLink2URL: https://api.kemet.com/component-edge/download/datasheet/C0603C100J5GACAUTO.pdf; ComponentLink2Description: Datasheet; Mouser Description: Multilayer Ceramic Capacitors MLCC - SMD/SMT 16volts 10000pF X7R 5%; Temperature: -55°C to +125°C; Digikey Description: CAP CER 10000PF 16V 5% X7R 0603; Octopart: https://octopart.com/c0603c103j4ractu-kemet-9139447; Capacitance: 10,000 pF; Category: Cap; Lead Free: Yes
C07 = CMP-2006-04543-1: Manufacturer: AVX Interconnect / Elco; Part Number: 0603YG105ZAT4A
C08 = CMP-2006-02256-2: CAP CER 4.7UF 6.3V X5R 0603; Manufacturer: Kemet; Temperature Coefficient: 15%; Tolerance: 10%; Material: Ceramic; Device Class L3: Ceramic Capacitors; RoHS: TRUE; Value: 4.7uF; Lead Free: Yes; ComponentLink2Description: Datasheet; Mouser Description: Multilayer Ceramic Capacitors MLCC - SMD/SMT 6.3volts 4.7uF X5R 10%; Package: C0603-CG; Digikey Description: CAP CER 4.7UF 6.3V X5R 0603; ComponentLink2URL: https://content.kemet.com/datasheets/KEM_C1006_X5R_SMD.pdf; Category: Cap; Temperature Range Low: -55°C; Capacitance: 4.7uF; Temperature: -55°C to +85°C; Octopart: https://octopart.com/c0603c475k9pactu-kemet-104242; Ipc Land Pattern Name: CAPC16080X80; Voltage Rating: 6.3V; Temperature Range High: +85°C; Height: 0.9mm; Temperature Characteristic: X5R; Device Class L1: Passive Components; Manufacturer Part Number: C0603C475K9PACTU; Automotive: No; Device Class L2: Capacitors
C11 C12 = CMP-03020-005801-1: CAP CER 4PF 100V NP0 0603; Manufacturer: KEMET; Temperature Coefficient: 30ppm/°C; Material: Ceramic; Value: 4.0 pF; Temperature Characteristic: C0G; Tolerance: 0.05 pF; Automotive: No; Temperature Range Low: -55°C; Package: CBR06C; Ipc Land Pattern Name: CAPC16080X80; Temperature: -55°C to +125°C; Device Class L2: Capacitors; RoHS: TRUE; Device Class L1: Passive Components; Mouser Description: Multilayer Ceramic Capacitors MLCC - SMD/SMT 4pF 100volts; Temperature Range High: +125°C; Height: 0.87mm; ComponentLink2URL: https://content.kemet.com/datasheets/KEM_C1030_CBR_SMD.pdf; Octopart: https://octopart.com/cbr06c409a1gac-kemet-23801648; Device Class L3: Ceramic Capacitors; Lead Free: Yes; Manufacturer Part Number: CBR06C409A1GAC; Voltage Rating: 100 V; Category: Cap; Capacitance: 4.0 pF; Digikey Description: CAP CER 4PF 100V NP0 0603; ComponentLink2Description: Datasheet
D1-D3 = CMP-2000-05198-2: LED GREEN CLEAR SMD; Max Power Dissipation: 75mW; Forward Current: 30mA; Reverse Voltage: 5V; Lens Color: Colorless; Forward Voltage: 2V; Dominant Wavelength: 571nm; Number of LEDs: 1; Viewing Angle: 130°; Lens Style: Rectangular; Test Current: 20mA; Luminous Intensity: 35mcd; Wavelength: 574nm; Width: 0.8mm; Case Code (Imperial): 0603; Number of Pins: 2; Lead Free: Lead Free; Packaging: Tape and Reel; Package Quantity: 1; Min Operating Temperature: -55°C; Case/Package: 0603; Length: 1.6mm; Power Dissipation: 75mW; Depth: 0.8mm; Radiation Hardening: No; Mount: Surface Mount; Max Operating Temperature: 85°C; Color: Green; Power Rating: 75mW; Height: 0.55mm; Illumination Color: Green; Case Code (Metric): 1608; Lens Transparency: Clear; Number of Elements: 1
R01 R02 R03 = CMP-2000-03062-2: RES Thick Film, 200Ω, 1%, 0.1W, 100ppm/°C, 0603; Power Rating: 100mW; Voltage Rating (DC): 75V; Resistance: 200R; Military Standard: Not; Tolerance: 1%; Lead Free: Lead Free; Case Code (Imperial): 0603; Depth: 0.85mm; Max Operating Temperature: 155°C; Contact Plating: Tin; Length: 1.55mm; Weight: 7.1E-05oz; Voltage Rating: 75V; Height: 0.45mm; Min Operating Temperature: -55°C; Case/Package: 0603; Number of Pins: 2; Composition: Thick Film; Termination: SMD/SMT; Case Code (Metric): 1608; Width: 0.85mm; Package Quantity: 5000; Temperature Coefficient: 100ppm/°C; Packaging: Tape and Reel
U01 = CMP-0237-00201-3: ARM Cortex-M3 32-bit MCU, 512 KB Flash, 64 KB Internal RAM, 51 I/Os, 64-pin LQFP, -40 to 85 degC, Tray; FLASH Size (Prog) (kB): 512; Internal RAM Size (kB): 64; A/D Converter: 3x12-bit (16 Channel); I/Os (High Current): 51; Supply Voltage(Vcc) min (V): 2; D/A Converter: 2x12-bit (2 Channel); Operating Frequency(F) (Processor speed) (MHz): 72; PackageDescription: 64-Pin Low Profile Quad Flat Package, 10 x 10 mm Body, 0.5 mm Pitch; ComponentLink3URL: http://www.st.com/st-web-ui/static/active/en/resource/technical/document/datasheet/DM00037051.pdf; DatasheetVersion: Rev. 8; Packing: Tray; PackageReference: LQFP64; ComponentLink3Description: Package Specification; Core: ARM Cortex-M3; Mounting Technology: Surface Mount; PartNumber: STM32F103RET6; PackageVersion: Rev. 4, 06/2013; ComponentLink1URL: http://www.st.com/web/en/home.html; ComponentLink1Description: Manufacturer URL; ComponentLink2Description: Datasheet; ComponentLink2URL: http://www.st.com/st-web-ui/static/active/en/resource/technical/document/datasheet/CD00191185.pdf
Y1 = CMP-27762-015610-1: Crystal 32.768kHz ±20ppm (Tol) 9pF FUND 70kΩ 2-Pin CSMD T/R; RoHS Compliant: Yes

## Sheet Connectors#1.SchDoc
size A; SheetNumber: 8; SheetTotal: 9
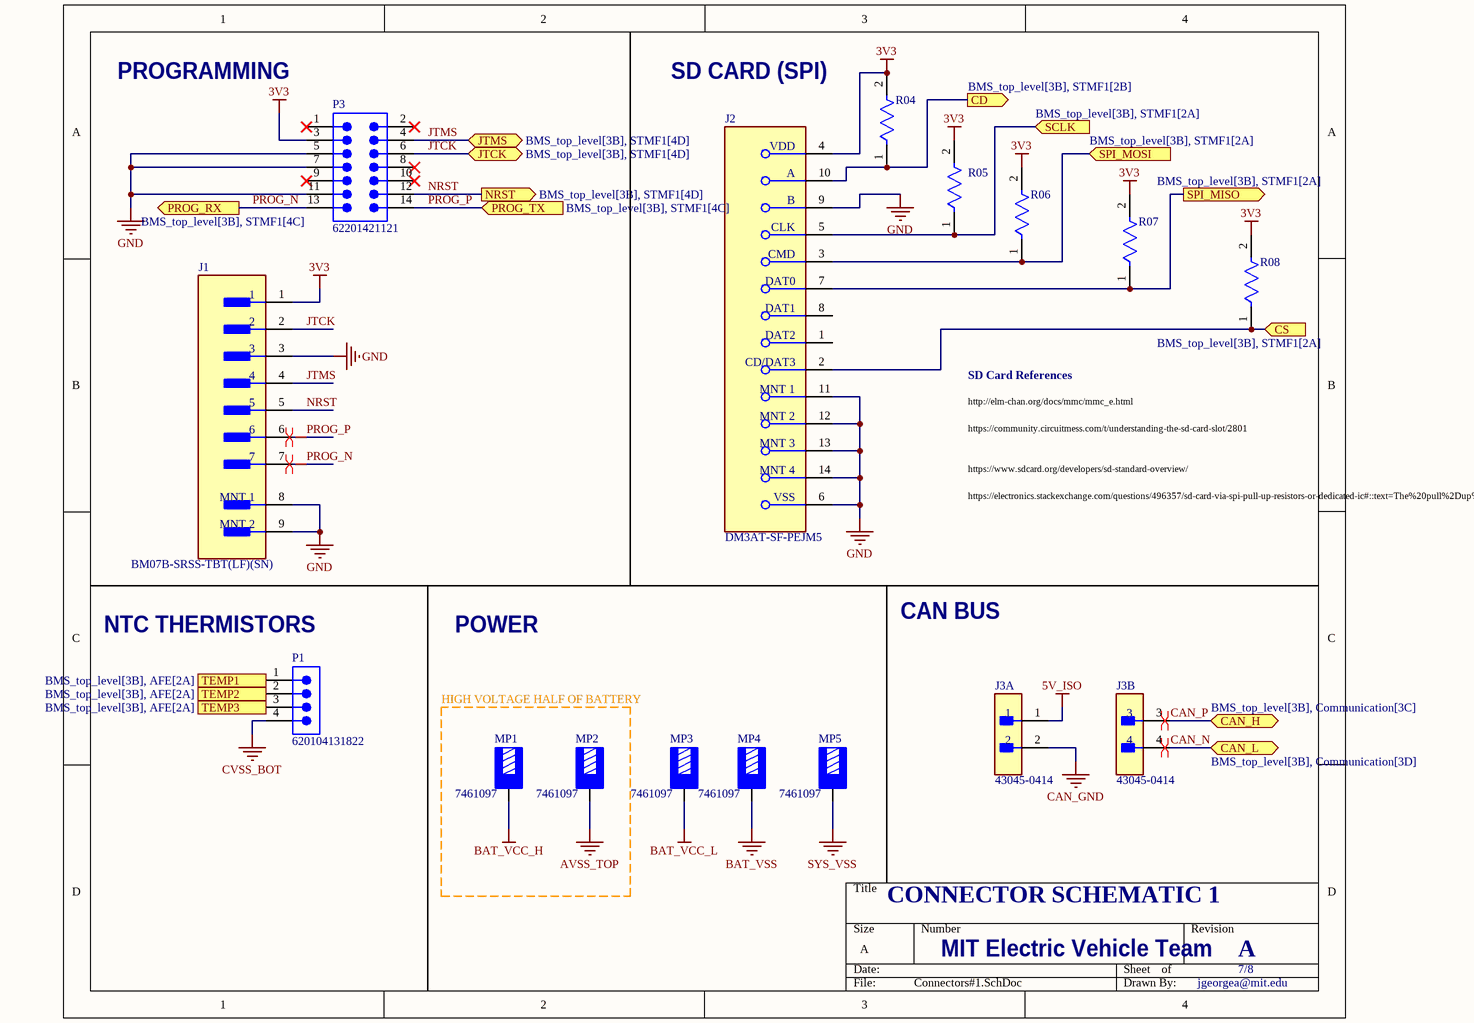
[diagram p3: Connectors#1.SchDoc]

### Parts
J1  BM07B-SRSS-TBT(LF)(SN)  [FP-BM07B-SRSS-TBT_LF_SN-MFG]
J2  DM3AT-SF-PEJM5  [FP-DM3AT-SF-PEJM5-MFG]
J3  43045-0414  [FP-43045-0414-MFG]  (parts A,B of 2)
MP1  7461097  [7461097_chemical surface]
MP2  7461097  [7461097_chemical surface]
MP3  7461097  [7461097_chemical surface]
MP4  7461097  [7461097_chemical surface]
MP5  7461097  [7461097_chemical surface]
P1  620104131822  [620104131822]
P3  62201421121  [62201421121]
R04  RC0603FR-0710KL  [FP-RC0603-0_55-IPC_C]  (value not drawn)
R05  RC0603FR-0710KL  [FP-RC0603-0_55-IPC_C]  (value not drawn)
R06  RC0603FR-0710KL  [FP-RC0603-0_55-IPC_C]  (value not drawn)
R07  RC0603FR-0710KL  [FP-RC0603-0_55-IPC_C]  (value not drawn)
R08  RC0603FR-0710KL  [FP-RC0603-0_55-IPC_C]  (value not drawn)

### Blocks framed on the sheet
HIGH VOLTAGE HALF OF BATTERY: MP1 MP2

### Ports
CAN_H (bidir, see BMS_top_level[3B], Communication[3C]), CAN_L (bidir, see BMS_top_level[3B], Communication[3D]), CD (out, see BMS_top_level[3B], STMF1[2B]), CS (in, see BMS_top_level[3B], STMF1[2A]), JTCK (bidir, see BMS_top_level[3B], STMF1[4D]), JTMS (bidir, see BMS_top_level[3B], STMF1[4D]), NRST (out, see BMS_top_level[3B], STMF1[4D]), PROG_RX (out, see BMS_top_level[3B], STMF1[4C]), PROG_TX (in, see BMS_top_level[3B], STMF1[4C]), SCLK (in, see BMS_top_level[3B], STMF1[2A]), SPI_MISO (out, see BMS_top_level[3B], STMF1[2A]), SPI_MOSI (in, see BMS_top_level[3B], STMF1[2A]), TEMP1 (out, see BMS_top_level[3B], AFE[2A]), TEMP2 (out, see BMS_top_level[3B], AFE[2A]), TEMP3 (out, see BMS_top_level[3B], AFE[2A])

### Nets
3V3: J1.1 J2.4(VDD) P3.3 R04.2 R05.2 R06.2 R07.2 R08.2
5V_ISO: J3.1
AVSS_TOP: MP2.1
BAT_VCC_H: MP1.1
BAT_VCC_L: MP3.1
BAT_VSS: MP4.1 P1.4  [also labelled CVSS_BOT]  [project net AVSS_BOT]
CAN_GND: J3.2
GND: J1.3 J1.8(MNT_1) J1.9(MNT_2) J2.6(VSS) J2.9(B) J2.11(MNT_1) J2.12(MNT_2) J2.13(MNT_3) J2.14(MNT_4) P3.5 P3.7 P3.11
SYS_VSS: MP5.1
CAN_N: J3.4 ; port CAN_L
CAN_P: J3.3 ; port CAN_H
JTCK: J1.2 P3.6 ; port JTCK
JTMS: J1.4 P3.4 ; port JTMS
NRST: J1.5 P3.12 ; port NRST
PROG_N: J1.7 P3.13 ; port PROG_RX
PROG_P: J1.6 P3.14 ; port PROG_TX
NetJ2_2: J2.2(CD/DAT3) R08.1 ; port CS
NetJ2_3: J2.3(CMD) R06.1 ; port SPI_MOSI
NetJ2_5: J2.5(CLK) R05.1 ; port SCLK
NetJ2_7: J2.7(DAT0) R07.1 ; port SPI_MISO
NetJ2_10: J2.10(A) R04.1 ; port CD
NetP1_1: P1.1 ; port TEMP1
NetP1_2: P1.2 ; port TEMP2
NetP1_3: P1.3 ; port TEMP3

Not connected (* = marked no-connect by the designer): J2 1(DAT2) 8(DAT1); P3 1* 2* 8* 9* 10*

### Layout directives
differential pair: CAN_N, CAN_P, PROG_N, PROG_P

### Notes on the sheet
- PROGRAMMING
- SD CARD (SPI)
- http://elm-chan.org/docs/mmc/mmc_e.html
- SD Card References
- https://community.circuitmess.com/t/understanding-the-sd-card-slot/2801
- https://www.sdcard.org/developers/sd-standard-overview/
- https://electronics.stackexchange.com/questions/496357/sd-card-via-spi-pull-up-resistors-or-dedicated-ic#::text=The%20pull%2Dup%20resistors%20are,the%20SD%20card%20(MISO.)
- (near P1) NTC THERMISTORS
- POWER
- CAN BUS
- CONNECTOR SCHEMATIC 1
- MIT Electric Vehicle Team
- A
- 7/8
- jgeorgea@mit.edu

### Library data of the parts
J1 = CMP-17439-000654-1: Connector Header Surface Mount 7 position 0.039" (1.00mm); Max Voltage Rating (AC): 50V; Max Current Rating: 1A; Contact Resistance: 40mR; Pitch: 1mm; Number of Positions: 7; Contact Material: Copper Alloy; Depth: 2.9mm; Contact Plating: Copper; Orientation: Straight; Termination: Solder; Max Operating Temperature: 85°C; Lead Free: Lead Free; Housing Material: Polyamide; Number of Rows: 1; Housing Color: Beige; Length: 9mm; Min Operating Temperature: -25°C; Packaging: Tape and Reel
J2 = CMP-2000-05150-2: CONN MICRO SD CARD PUSH-PUSH R/A; Current Rating: 500mA; Number of Contacts: 8; Pitch: 1.1mm; Gender: Female; Connector Type: Connector; Max Voltage Rating (AC): 125V; Min Operating Temperature: -25°C; Length: 15.95mm; Packaging: Tape and Reel; Width: 13.85mm; Flammability Rating: UL94 V-0; Termination: SMD/SMT; Contact Material: Copper Alloy; Depth: 15.95mm; Radiation Hardening: No; Number of Rows: 1; Max Operating Temperature: 85°C; Housing Material: Polymer; Height: 1.68mm; Package Quantity: 1; Orientation: Right Angle; REACH SVHC: No SVHC; Mount: Surface Mount; Max Current Rating: 500mA; Number of Positions: 8; Lead Free: Lead Free; Contact Plating: Gold; Voltage Rating: 125V
J3 = CMP-04776-000520-1: CONN HEADER VERT 4POS 3MM; Approvals: UL; Current Rating: 5A; Insulation Resistance: 1GR; Max Voltage Rating (DC): 250.25kV; Gender: Male; Number of Positions: 4; Glow Wire Compliant: Compliant; Voltage Rating: 600V; Contact Resistance: 10mR; Voltage Rating (DC): 250V; Pitch: 3mm; Halogen Free: Low Halogen; Flammability Rating: UL94 V-0; Max Current Rating: 5A; Contact Material: Brass; Case/Package: 0414; Contact Plating: Gold; Number of Rows: 2; Number of Contacts: 4; Diameter: 3mm; Depth: 8.77mm; Row Spacing: 3mm; Housing Color: Black; Termination: Solder; Package Quantity: 2232; Max Operating Temperature: 105°C; Number of Circuits: 4; Lead Free: Lead Free; Color: Black; Orientation: Vertical; Height: 9.91mm; Series: 43045; Packaging: Tray; Mount: Through Hole; Length: 10.15mm; Min Operating Temperature: -40°C; Housing Material: Thermoplastic; REACH SVHC: No SVHC
MP1-MP5 = CMP-03913-18187405-1: 7461097 16 Pin Power Element, Copper Zinc Alloy, 240A, M6, Vertical; Current Rating: 180A; Insulation: Non-Insulated; Number of Contacts: 16; Thread Size: M6; Number of Pins: 16; Mount: Through Hole; Packaging: Bulk; REACH SVHC: Unknown; Max Operating Temperature: 150°C; Contact Plating: Tin; Width: 10mm; Material: Brass; Length: 10mm; Height: 14mm; Min Operating Temperature: -55°C; Contact Material: Copper; Termination: Press-Fit; NexarPartId: 18187405; RoHS: Compliant
P1 = CMP-1502-00671-2: NexarPartId: 18818240; Number of Positions: 4; Operating Supply Voltage: 100V; Connector Type: Male Pin; Insulation: Insulated; Pitch: 2mm; Insulation Resistance: 1GΩ; Contact Resistance: 20mΩ; Voltage Rating: 125V; Current Rating: 2A; Gender: Male; Width: 12mm; Flammability Rating: UL94 V-0; Contact Gender: Male; REACH SVHC: Unknown; Packaging: Tape and Reel; Contact Plating: Tin; Termination: SMD/SMT; Number of Rows: 1; Mount: Surface Mount; Contact Mating Length: 3.683mm; Lead Free: Lead Free; Housing Material: Nylon; Number of Contacts: 4; RoHS: Compliant; Min Operating Temperature: -40°C; Number of Pins: 4; Length: 12mm; Height: 5.6mm; Max Operating Temperature: 85°C; Color: Beige, White; Contact Material: Copper; Lead Pitch: 2mm
P3 = CMP-1502-00949-2: NexarPartId: 32855587; Current Rating: 1A; Row Spacing: 1.27mm; Connector Type: Male Pin; Number of Contacts: 14; Contact Resistance: 20mΩ; Gender: Male; Operating Supply Voltage: 100V; Contact Mating Length: 3.81mm; REACH SVHC: Unknown; Lead Pitch: 1.27mm; Packaging: Box; Contact Material: Copper; Color: Black; Orientation: Vertical; Termination: Solder; Number of Positions: 14; Contact Plating: Gold; Number of Rows: 2; RoHS: Compliant; Mount: Through Hole; Number of Pins: 14; Pitch: 1.27mm
R04 R05 R06 R07 R08 = CMP-2100-03664-2: RES 10K OHM 1% 1/10W 0603; Voltage Rating: 75V; Voltage Rating (DC): 50V; Resistance: 10kR; Power Rating: 100mW; Temperature Coefficient: 100ppm/°C; Depth: 0.8mm; Termination: SMD/SMT; Resistor Type: Thick Film; Series: RC; Construction: Rectangular; Features: Moisture Resistant; Packaging: Tape and Reel; Min Operating Temperature: -55°C; Number of Terminations: 2; Lead Pitch: 0.3mm; RoHS Compliant: Yes; Case/Package: 0603; Resistance Tolerance: 1%; Military Standard: Not; Weight: 7.1E-05oz; Number of Pins: 2; Tolerance: 1%; Length: 1.6mm; Case Code (Imperial): 0603; Lead Free: Lead Free; Width: 0.8mm; Max Power Dissipation: 100mW; Height: 0.45mm; Max Operating Temperature: 155°C; Case Code (Metric): 1608; Size Code: 0603